# EAGLE design ventmon_t0.5e (EAGLE 9.6.2)

## Sheet 1 of 2

## Sheet 2 of 2
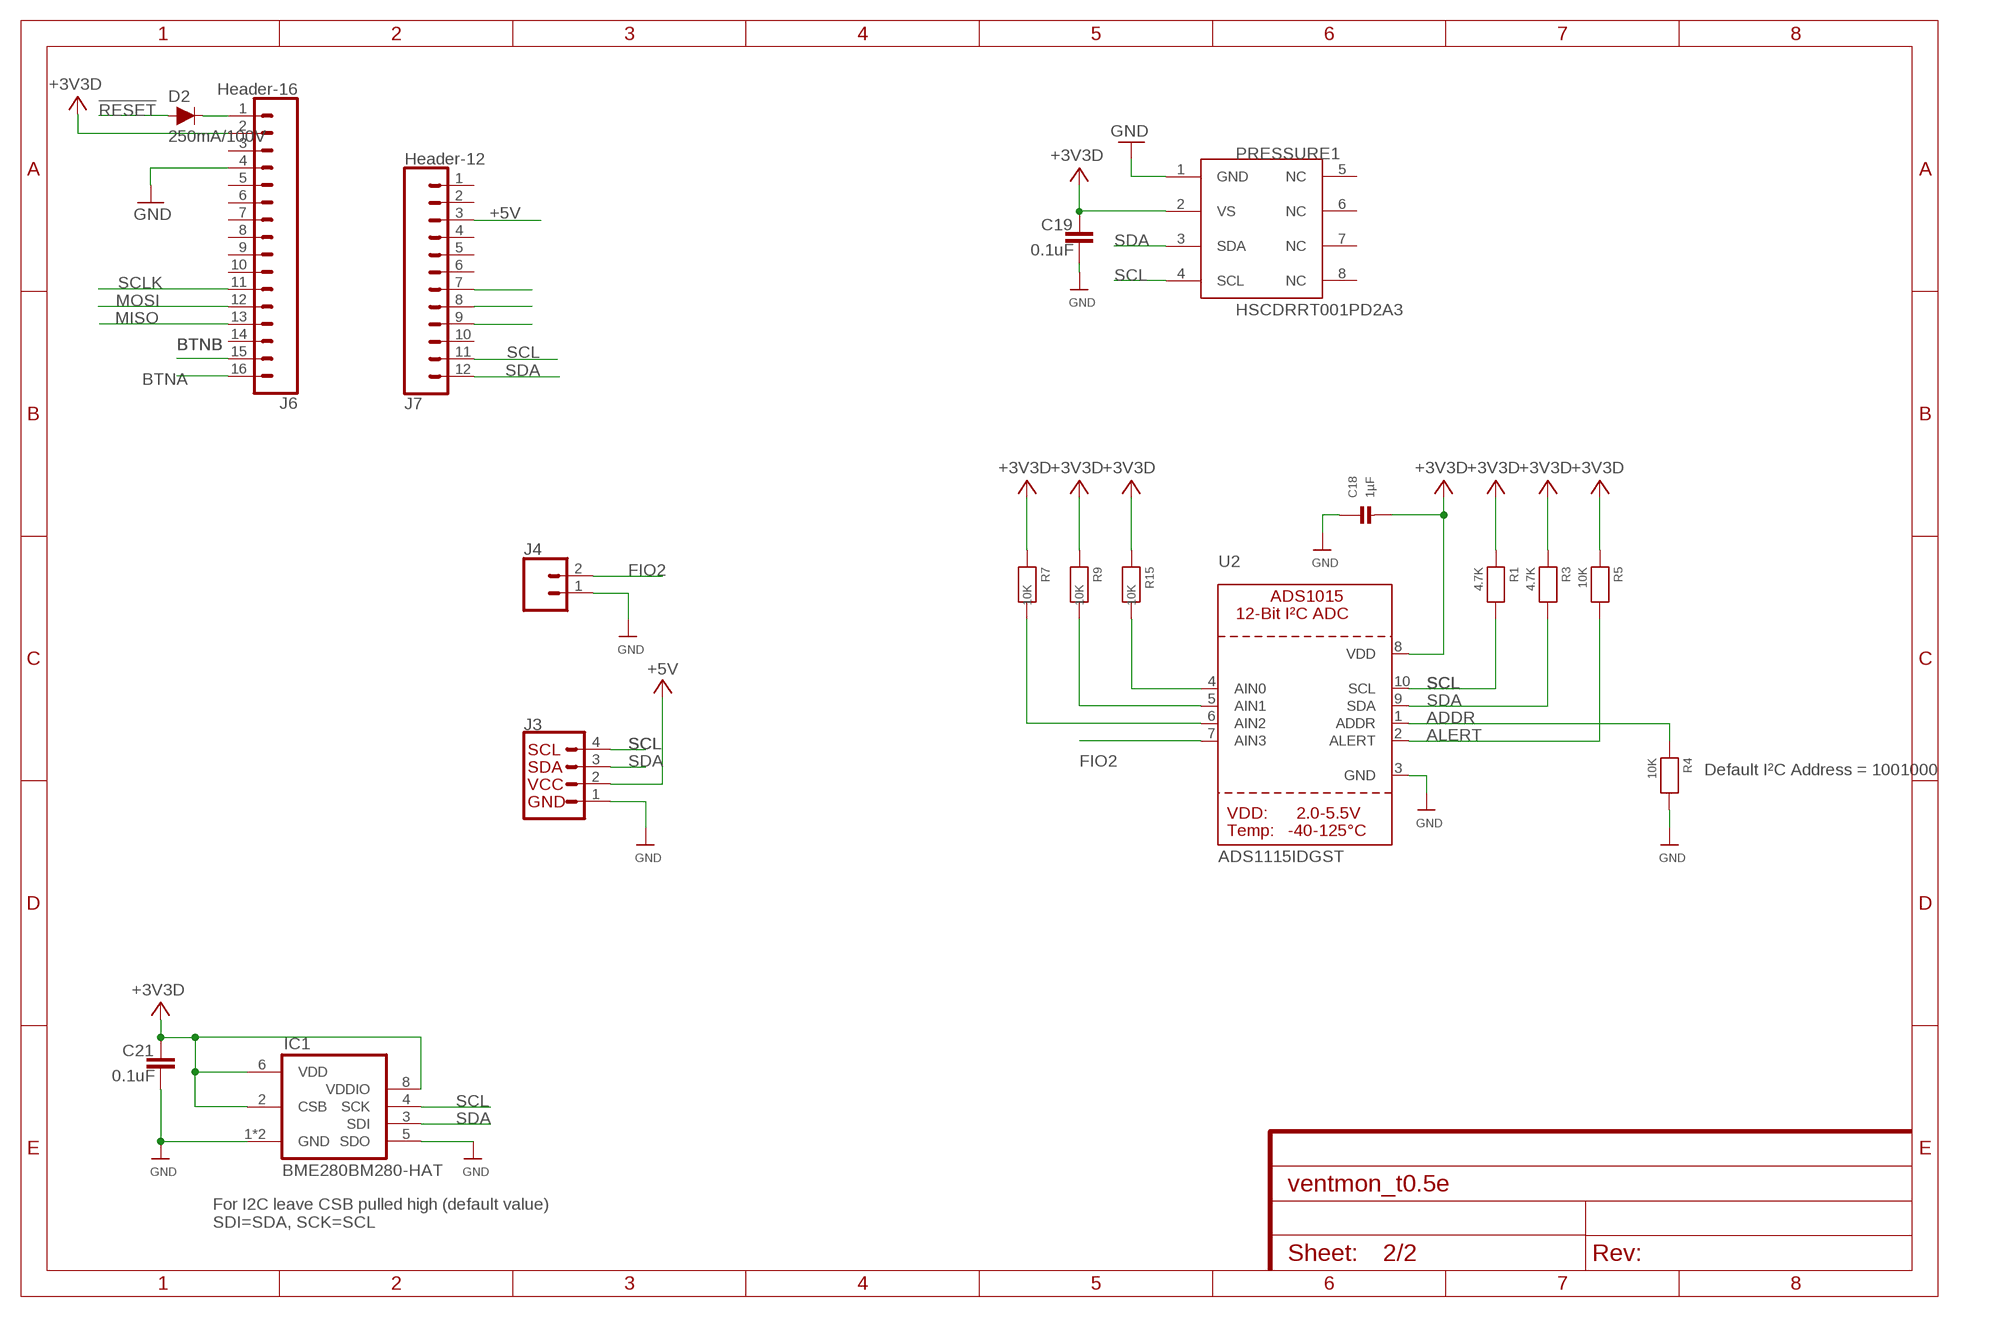
[diagram p0: schematic, sheet 2]

### Parts
C18  1µF  CAP_CERAMIC0603  [0603]
C19  0.1uF  CAP_1  [C0402_B]
C21  0.1uF  CAP_1  [C0402_B]
D2  250mA/100V  DIODE-BAS16J  [SOD-323]
IC1  BME280BM280-HAT  [BME280-HAT]
J3  QWIIC_CONNECTORJS-1MM  [1X04_1MM_RA]
J4  CONN_02  [1X02]
J6  Header-16  CONN_16  [1X16]
J7  Header-12  CONN_12  [1X12]
PRESSURE1  HSCDRRT001PD2A3  [DIP1330W46P254L1000H616Q8B]
R1  4.7K  RESISTOR0603  [0603]
R3  4.7K  RESISTOR0603  [0603]
R4  10K  RESISTOR0603  [0603]
R5  10K  RESISTOR0603  [0603]
R7  10K  RESISTOR0603  [0603]
R9  10K  RESISTOR0603  [0603]
R15  10K  RESISTOR0603  [0603]
U2  ADS1115IDGST  ADC_ADS1015  [MSOP10]

### Nets
!RESET: D2.A
+3V3: C18.2 C19.2 C21.2 IC1.2(CSB) IC1.6(VDD) IC1.8(VDDIO) J6.2 PRESSURE1.2(VS) R1.1 R3.1 R5.1 R7.1 R9.1 R15.1 U2.8(VDD) ; supply symbol labelled +3V3D
+5V: J3.2(VCC) J7.3
ADDR: R4.1 U2.1(ADDR)
ALERT: R5.2 U2.2(ALERT)
BTNA: J6.16
BTNB: J6.15
FIO2: J4.2 U2.7(AIN3)
GND: C18.1 C19.1 C21.1 IC1.1(GND) IC1.5(SDO) IC1.7(GND) J3.1(GND) J4.1 J6.4 PRESSURE1.1(GND) R4.2 U2.3(GND)
MISO: J6.13
MOSI: J6.12
N$4: D2.C J6.1
N$24: J7.7
N$25: J7.8
N$26: J7.9
N$38: R7.2 U2.6(AIN2)
N$40: R9.2 U2.5(AIN1)
N$45: R15.2 U2.4(AIN0)
SCL: IC1.4(SCK) J3.4(SCL) J7.11 PRESSURE1.4(SCL) R1.2 U2.10(SCL)
SCLK: J6.11
SDA: IC1.3(SDI) J3.3(SDA) J7.12 PRESSURE1.3(SDA) R3.2 U2.9(SDA)
Unconnected: J6.3 J6.5 J6.6 J6.7 J6.8 J6.9 J6.10 J6.14 J7.1 J7.2 J7.4 J7.5 J7.6 J7.10 PRESSURE1.5(NC) PRESSURE1.6(NC) PRESSURE1.7(NC) PRESSURE1.8(NC)

### Notes on the sheet
- Default I²C Address = 1001000
- For I2C leave CSB pulled high (default value)
  SDI=SDA, SCK=SCL

## Library data of the parts
C18 = microbuilder:CAP_CERAMIC: Ceramic Capacitors 0402 - 0402 Surface Mount Capacitors 16pF 50V 5% [Digikey: 445-4899-2-ND] 18pF 50V 5% [Digikey: 490-1281-2-ND] 22pF 50V 5% [Digikey: 490-1283-2-ND] 68pF 50V 5% [Digikey: 490-1289-2-ND] 0.1uF 10V 10% [Digikey: 490-1318-2-ND] 1.0uF 6.3V 10% [Digikey: 490-1320-2-ND] 0603 - 0603 Surface Mount Capacitors 16 pF 50V 5% [Digikey: 445-5051-2-ND] 22 pF 50V [Digikey: PCC220ACVTR-ND] 33 pF 50V 5% [Digikey: 490-1415-1-ND] 56pF 50V 5% [Digikey: 490-1421-1-ND] 220pF 50V 5% [Digikey: 445-1285-1-ND] 680 pF 50V 2200 pF 50V 5% C0G [Digikey: 445-1297-1-ND] 5600 pF 100V 5% X7R [Digikey: 478-3711-1-ND] 0.1 µF 25V 10% [Digikey: PCC2277TR-ND] 0.22 µF 16V 10% X7R [Digikey: 445-1318-1-ND] 1.0 µF 25V 10% [Digikey: 445-5146-2-ND] 0603 - RF Specific 3pF 250V +/-0.1pF RF [Digikey: 712-1347-1-ND] 18 pF 250V 5% [Digikey: 478-3505-1-ND or 712-1322-1-ND] 56 pF 250V 5% C0G RF [Digikey: 490-4867-1-ND] 68 pF 250V RF [Digikey: 490-4868-1-ND] 0805 - 0805 Surface Mount Capacitors 220 pF 250V 2% RF Ceramic Capacitor [Digikey: 712-1398-1-ND] 1000 pF 50V 2% NP0 Ceramic Capacitor [Digikey: 478-3760-1-ND] 0.1 µF 25V 10% Ceramic Capacitor [Digikey: PCC1828TR-ND] 1.0 µF 16V 10% Ceramic Capacitor[Digikey: 490-1691-2-ND] 10.0 µF 10V 10% Ceramic Capacitor[Digikey: 709-1228-1-ND] 10.0 uF 16V 10% Ceramic Capacitor [Digikey: 478-5165-2-ND] 47 uF 6.3V 20% Ceramic Capacitor [Digikey: 587-1779-1-ND or 399-5506-1-ND] 1206 - 1206 Surface Mount Capacitors 47uF 10V 20% Ceramic Capacitor [Digikey: 490-5528-1-ND or 399-5508-1-ND or 445-6010-1-ND] 100uF 6.3V -20%, +80% Y5V Ceramic Capacitor (Digikey: 490-4512-1-ND, Mouser: 81-GRM31CF50J107ZE1L)
C19 C21 = Particle:CAP_1
D2 = SparkFun-DiscreteSemi:DIODE: Diode These are standard reverse protection diodes and small signal diodes. SparkFun Products: SparkFun SparkPunk Sound Kit <https://www.sparkfun.com/products/11177> SparkFun ESP8266 Thing <https://www.sparkfun.com/products/13231>; PROD_ID: DIO-09646
IC1 = bosch-bme280:BME280: DIGITAL HUMIDITY, PRESSURE AND TEMPERATURE SENSOR * Digital interface I²C (up to 3.4 MHz) and SPI (3 and 4 wire, up to 10 MHz)* Supply voltage VDD main supply voltage range: 1.71 V to 3.6 V*VDDIO interface voltage range: 1.2 V to 3.6 V Operating range -40…+85 °C, 0…100 % rel. humidity, 300…1100 hPa The library has been designed by Richard Magdycz <https://www.facebook.com/groups/eaglecadsoftUK>
J3 = SparkFun-Connectors:QWIIC_CONNECTOR: SparkFun I2C Standard Qwiic Connector An SMD 1mm pitch JST connector makes it easy and quick (get it? Qwiic?) to connect I2C devices to each other. The Qwiic system <http://www.sparkfun.com/qwiic> enables fast and solderless connection between popular platforms and various sensors and actuators. We carry 200mm <https://www.sparkfun.com/products/14204>, 100mm <https://www.sparkfun.com/products/14205>, 50mm <https://www.sparkfun.com/products/14206>, and breadboard friendly <https://www.sparkfun.com/products/14207> Qwiic cables. We also offer 10 pcs strips <https://www.sparkfun.com/products/14323> the SMD connectors.
J4 = SparkFun-Connectors:CONN_02: Multi connection point. Often used as Generic Header-pin footprint for 0.1 inch spaced/style header connections On any of the 0.1 inch spaced packages, you can populate with these: Break Away Headers - Straight <https://www.sparkfun.com/products/116> (PRT-00116) Break Away Male Headers - Right Angle <https://www.sparkfun.com/products/553> (PRT-00553) Female Headers <https://www.sparkfun.com/products/115> (PRT-00115) Break Away Headers - Machine Pin <https://www.sparkfun.com/products/117> (PRT-00117) Break Away Female Headers - Swiss Machine Pin <https://www.sparkfun.com/products/743> (PRT-00743) For SCREWTERMINALS and SPRING TERMINALS visit here: Screw Terimnals on SparkFun.com <https://www.sparkfun.com/search/results?term=Screw+Terminals> (5mm/3.5mm/2.54mm spacing) This device is also useful as a general connection point to wire up your design to another part of your project. Our various solder wires solder well into these plated through hole pads. Hook-Up Wire - Assortment (Stranded, 22 AWG) <https://www.sparkfun.com/products/11375> (PRT-11375) Hook-Up Wire - Assortment (Solid Core, 22 AWG) <https://www.sparkfun.com/products/11367> (PRT-11367) View the entire wire category on our website here <https://www.sparkfun.com/categories/141> Special notes: Molex polarized connector foot print use with: PRT-08233 with associated crimp pins and housings. 2.54_SCREWTERM for use with PRT-10571. 3.5mm Screw Terminal footprints for PRT-08084 5mm Screw Terminal footprints for use with PRT-08432
J6 = SparkFun-Connectors:CONN_16: Multi connection point. Often used as Generic Header-pin footprint for 0.1 inch spaced/style header connections On any of the 0.1 inch spaced packages, you can populate with these: Break Away Headers - Straight <https://www.sparkfun.com/products/116> (PRT-00116) Break Away Male Headers - Right Angle <https://www.sparkfun.com/products/553> (PRT-00553) Female Headers <https://www.sparkfun.com/products/115> (PRT-00115) Break Away Headers - Machine Pin <https://www.sparkfun.com/products/117> (PRT-00117) Break Away Female Headers - Swiss Machine Pin <https://www.sparkfun.com/products/743> (PRT-00743) For SCREWTERMINALS and SPRING TERMINALS visit here: Screw Terimnals on SparkFun.com <https://www.sparkfun.com/search/results?term=Screw+Terminals> (5mm/3.5mm/2.54mm spacing) This device is also useful as a general connection point to wire up your design to another part of your project. Our various solder wires solder well into these plated through hole pads. Hook-Up Wire - Assortment (Stranded, 22 AWG) <https://www.sparkfun.com/products/11375> (PRT-11375) Hook-Up Wire - Assortment (Solid Core, 22 AWG) <https://www.sparkfun.com/products/11367> (PRT-11367) View the entire wire category on our website here <https://www.sparkfun.com/categories/141> Special notes: Molex polarized connector foot print use with SKU : PRT-08231 with associated crimp pins and housings. 1MM SMD Version SKU: PRT-10208 NOTES ON THE VARIANTS LOCK and LOCK_LONGPADS... This footprint was designed to help hold the alignment of a through-hole component (i.e. 6-pin header) while soldering it into place. You may notice that each hole has been shifted either up or down by 0.005 of an inch from it's more standard position (which is a perfectly straight line). This slight alteration caused the pins (the squares in the middle) to touch the edges of the holes. Because they are alternating, it causes a "brace" to hold the component in place. 0.005 has proven to be the perfect amount of "off-center" position when using our standard breakaway headers. Although looks a little odd when you look at the bare footprint, once you have a header in there, the alteration is very hard to notice. Also,if you push a header all the way into place, it is covered up entirely on the bottom side.
J7 = SparkFun-Connectors:CONN_12: Multi connection point. Often used as Generic Header-pin footprint for 0.1 inch spaced/style header connections On any of the 0.1 inch spaced packages, you can populate with these: Break Away Headers - Straight <https://www.sparkfun.com/products/116> (PRT-00116) Break Away Male Headers - Right Angle <https://www.sparkfun.com/products/553> (PRT-00553) Female Headers <https://www.sparkfun.com/products/115> (PRT-00115) Break Away Headers - Machine Pin <https://www.sparkfun.com/products/117> (PRT-00117) Break Away Female Headers - Swiss Machine Pin <https://www.sparkfun.com/products/743> (PRT-00743) For SCREWTERMINALS and SPRING TERMINALS visit here: Screw Terimnals on SparkFun.com <https://www.sparkfun.com/search/results?term=Screw+Terminals> (5mm/3.5mm/2.54mm spacing) This device is also useful as a general connection point to wire up your design to another part of your project. Our various solder wires solder well into these plated through hole pads. Hook-Up Wire - Assortment (Stranded, 22 AWG) <https://www.sparkfun.com/products/11375> (PRT-11375) Hook-Up Wire - Assortment (Solid Core, 22 AWG) <https://www.sparkfun.com/products/11367> (PRT-11367) View the entire wire category on our website here <https://www.sparkfun.com/categories/141> Special notes: Molex polarized connector foot print use with SKU : PRT-08231 with associated crimp pins and housings. 1MM SMD Version SKU: PRT-10208 NOTES ON THE VARIANTS LOCK and LOCK_LONGPADS... This footprint was designed to help hold the alignment of a through-hole component (i.e. 6-pin header) while soldering it into place. You may notice that each hole has been shifted either up or down by 0.005 of an inch from it's more standard position (which is a perfectly straight line). This slight alteration caused the pins (the squares in the middle) to touch the edges of the holes. Because they are alternating, it causes a "brace" to hold the component in place. 0.005 has proven to be the perfect amount of "off-center" position when using our standard breakaway headers. Although looks a little odd when you look at the bare footprint, once you have a header in there, the alteration is very hard to notice. Also,if you push a header all the way into place, it is covered up entirely on the bottom side.
PRESSURE1 = HSCDRRT001PD2A3:HSCDRRT001PD2A3: Honeywell Differential Pressure Sensor Pressure Sensor ±1PSI (±6.89kPa) Differential Male - 0.08" (1.93mm) Tube, Dual 12 b 8-DIP (0.524", 13.30mm), Dual Ports, Same Side, I2C https://www.digikey.com/product-detail/en/honeywell-sensing-and-productivity-solutions/HSCDRRT001PD2A3/480-3335-ND/2601662
R1 R3-R5 R7 R9 R15 = microbuilder:RESISTOR: Resistors 0402 - 0402 Surface Mount Package 22 Ohm 1% 1/16W [Digikey: 311-22.0LRTR-ND] 33 Ohm 5% 1/16W 1.0K 5% 1/16W 1.5K 5% 1/16W 2.0K 1% 1/16W 10.0K 1% 1/16W [Digikey: 311-10.0KLRTR-ND] 10.0K 5% 1/16W [Digikey: RMCF0402JT10K0TR-ND] 12.1K 1% 1/16W [Digikey: 311-22.0LRTR-ND] 100.0K 5% 1/16W 0603 - 0603 Surface Mount Package 0 Ohm 1/10 Watt 1% Resistor 15 Ohm 1/10 Watt 1% Resistor 33 Ohm 1/10 Watt 1% Resistor 49.9 Ohm 1/10 Watt 1% Resistor 100 Ohm 1/10 Watt 1% Resistor 150 Ohm 1/10 Watt 1% Resistor 240 Ohm 1/10 Watt 1% Resistor 390 Ohm 1/10 Watt 1% Resistor 560 Ohm 1/10 Watt 1% Resistor 680 Ohm 1/10 Watt 1% Resistor 750 Ohm 1/10 Watt 1% Resistor 1.0K Ohm 1/10 Watt 1% Resistor 1.5K Ohm 1/10 Watt 1% Resistor 2.0K Ohm 1/10 Watt 1% Resistor 2.2K Ohm 1/10 Watt 1% Resistor 3.3K Ohm 1/10 Watt 1% Resistor 4.7K Ohm 1/10 Watt 1% Resistor 10.0K Ohm 1/10 Watt 1% Resistor 12.0K Ohm 1/10 Watt 1% Resistor 12.1K Ohm 1/10 Watt 1% Resistor 20.0K Ohm 1/10 Watt 1% Resistor 33.0K Ohm 1/10 Watt 1% Resistor 100.0K Ohm 1/10 Watt 1% Resistor 0805 - 0805 Surface Mount Package 0 Ohm 1/8 Watt 1% Resistor 33 Ohm 1/8 Watt 1% Resistor 100 Ohm 1/8 Watt 1% Resistor 150 Ohm 1/8 Watt 1% Resistor 200 Ohm 1/8 Watt 1% Resistor 240 Ohm 1/8 Watt 1% Resistor 330 Ohm 1/8 Watt 1% Resistor 390 Ohm 1/8 Watt 1% Resistor 470 Ohm 1/8 Watt 1% Resistor 1.0K Ohm 1/8 Watt 1% Resistor 1.5K Ohm 1/8 Watt 1% Resistor 2.0K Ohm 1/8 Watt 1% Resistor 4.7K Ohm 1/8 Watt 1% Resistor 5.1K Ohm 1/8 Watt 1% Resistor 5.6K Ohm 1/8 Watt 1% Resistor 10.0K Ohm 1/8 Watt 1% Resistor 22.0K Ohm 1/8 Watt 1% Resistor 33.0K Ohm 1/8 Watt 1% Resistor 100K Ohm 1/8 Watt 1% Resistor 1206 - 1206 Surface Mount Package 2012 - 2010 Surface Mount Package 0.11 Ohm 1/2 Watt 1% Resistor - Digikey: RHM.11UCT-ND
U2 = microbuilder:ADC_ADS1015: ADS1015 - 12-bit 4-Channel I2C ADC with Internal PGA VDD: 2.0-5.5V Sampling Rate: 3.3ksps Gain Settings: 2/3, 1, 2, 4, 8, 16 I2C Address: ADDR low = 1001000x, ADDR high = 1001001x Internal Comparator The ADS1015 includes an internal comparator that can be set to output a high-level on ALERT when the conversion results exceeeds a pre-defined upper level, and will deassert itself when the level falls below a pre-defined lower threshold level. It can also be set to windowed mode where the ALERT pin will be asserted if the data exceeds the upper threshold or falls below the lower threshold.

## Board
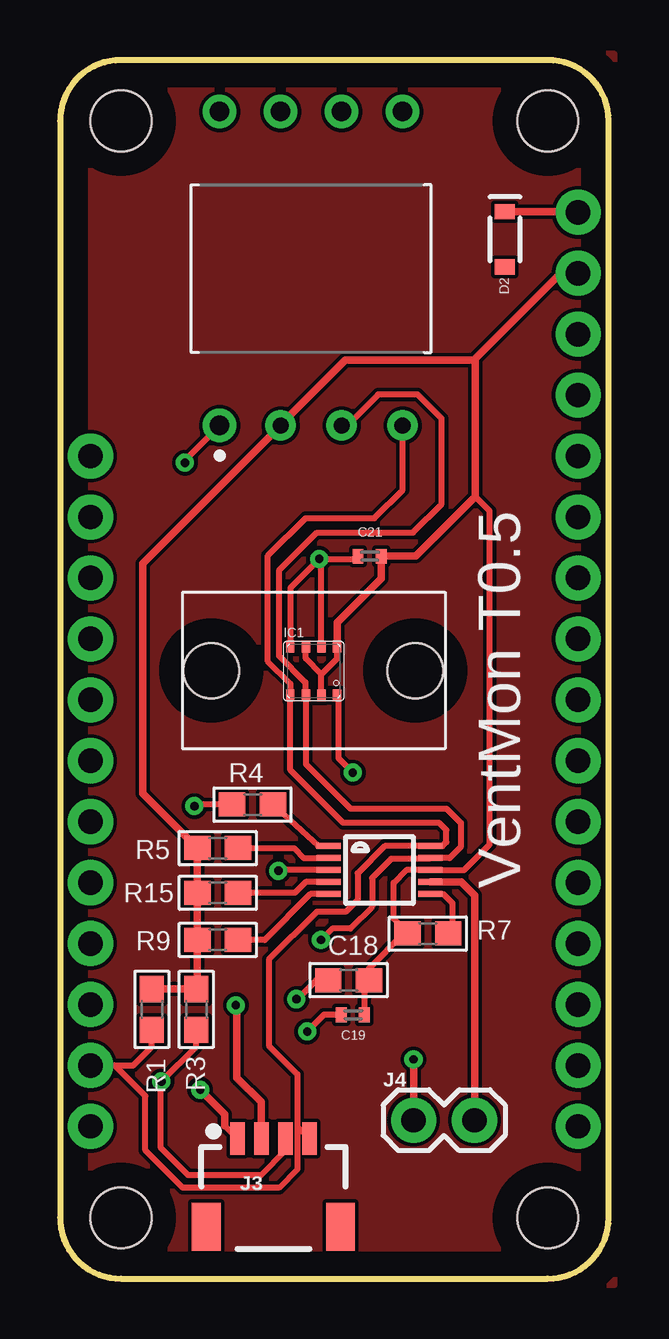
[diagram p1: board, top side]
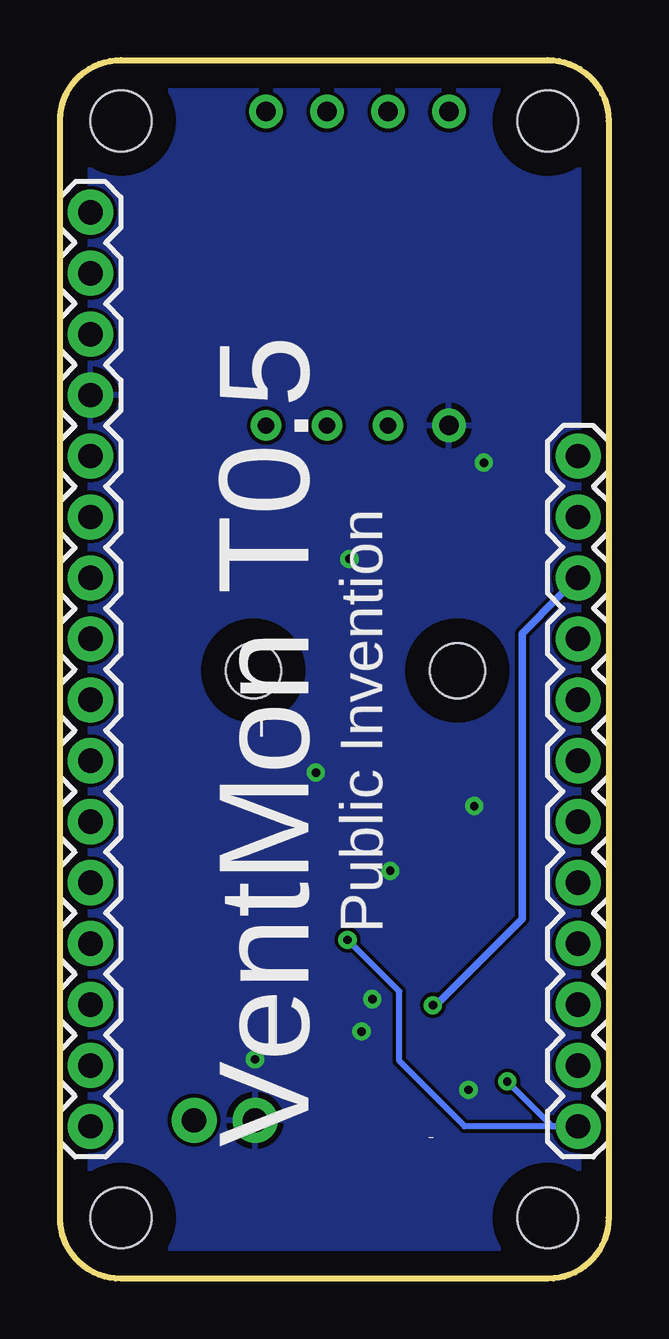
[diagram p2: board, bottom side, seen from below]

Size 22.86 x 50.8 mm. Coordinates in mm from the lower left corner, seen from the top.
Outline: 20.32,50.8 2.54,50.8 arc90 0,48.26 0,2.54 arc90 2.54,0 20.32,0 arc90 22.86,2.54 22.86,48.26 arc90 20.32,50.8
Copper layers (1*16): Top 0.035mm / dielectric 1.5mm / Bottom 0.035mm
Design rules "default *": minimum track width 6mil, minimum drill 10mil, track to track 6mil, track to pad 6mil, pad to pad 6mil, via to via 6mil, smd to smd 6mil, copper to edge 40mil, drill to drill 6mil, minimum pad ring 10mil, minimum via ring 8mil, stop-mask expansion 4mil, vias tented up to drill 0.35mm, thermal gap 10mil
Holes 2.54 mm at 20.32,48.26 2.54,48.26 2.54,2.54 20.32,2.54

### Footprints (pad centres in the part's own frame; a part is rotated, then mirrored left to right if it is on the bottom)
0603 = smd 1.1 x 1: 1 -0.85,0; 2 0.85,0
C0402_B = smd 0.457 x 0.61: 1 -0.483,0; 2 0.483,0
SOD-323 = smd 0.63 x 0.83: A 1.15,0; C -1.15,0
BME280-HAT = smd 0.35 x 0.5: 1 2.245,-2.295; 2 1.595,-2.295; 3 0.945,-2.295; 4 0.295,-2.295; 5 0.295,-0.245; 6 0.945,-0.245; 7 1.595,-0.245; 8 2.245,-0.245 | hole 2.3: 5.5,-1.25; -3,-1.25
1X04_1MM_RA = smd 0.6 x 1.35: 1 -1.5,0; 2 -0.5,0; 3 0.5,0; 4 1.5,0 | smd 1.2 x 2: NC1 2.8,-3.675; NC2 -2.8,-3.675
1X02 = drill 1.016 pad 1.88: 1 0,0; 2 2.54,0
1X16 = drill 1.016 pad 1.88: 1 0,0; 2 2.54,0; 3 5.08,0; 4 7.62,0; 5 10.16,0; 6 12.7,0; 7 15.24,0; 8 17.78,0; 9 20.32,0; 10 22.86,0; 11 25.4,0; 12 27.94,0; 13 30.48,0; 14 33.02,0; 15 35.56,0; 16 38.1,0
1X12 = drill 1.016 pad 1.88: 1 0,0; 2 2.54,0; 3 5.08,0; 4 7.62,0; 5 10.16,0; 6 12.7,0; 7 15.24,0; 8 17.78,0; 9 20.32,0; 10 22.86,0; 11 25.4,0; 12 27.94,0
DIP1330W46P254L1000H616Q8B = drill 0.813 pad 1.397: 1 -6.54,3.81; 5 6.54,-3.81; 6 6.54,-1.27; 7 6.54,1.27; 8 6.54,3.81 | drill 0.675 pad 1.275: 2 -6.54,1.27; 3 -6.54,-1.27; 4 -6.54,-3.81
MSOP10 = smd 0.25 x 1: 1 -1,-2.113; 2 -0.5,-2.113; 3 0,-2.113; 4 0.5,-2.113; 5 1,-2.113; 6 1,2.113; 7 0.5,2.113; 8 0,2.113; 9 -0.5,2.113; 10 -1,2.113

### Placement (x,y rotation side)
C18  12.03,12.44 0 top
C19  12.2,11 0 top
C21  12.9,30.12 0 top
D2  18.54,43.32 270 top
IC1  9.3,26.6 0 top
J3  8.89,5.84 0 top
J4  14.73,6.6 0 top
J6  21.59,44.45 270 bottom
J7  1.27,34.29 270 bottom
PRESSURE1  10.46,42.1 90 top
R1  3.83,11.22 270 top
R3  5.68,11.22 270 top
R4  8.02,19.76 180 top
R5  6.57,17.95 0 top
R7  15.32,14.39 0 top
R9  6.57,14.12 0 top
R15  6.57,16.08 0 top
U2  13.31,17.03 270 top

### Tracks (layer width: path | path; a pad name or v marks a point on that pad's centre or on a via)
+3V3
  Top 0.254: 17.3,32.6 17.9,32 17.9,18.1 16.83,17.03 U2.8 14.43,17.03 13.9,16.5 13.9,15 14.47,14.43 R7.1 14.31,14.38 12.88,12.95 C18.2 12.69,12.26 C19.2 | 10.89,25.2 11.54,25.84 IC1.8 | 10.89,25.2 10.24,25.84 IC1.6 | R3.1 5.72,12.12 | IC1.2 10.89,25.2
  Top 0.305: IC1.8 11.54,27.34 13.38,29.18 C21.2 14.82,30.12 17.3,32.6 17.3,38.35 | J6.2 20.86,41.91 17.3,38.35 | 17.3,38.35 17.25,38.3 11.88,38.3 9.2,35.61 PRESSURE1.2 3.45,29.82 3.45,20.23 R5.1 R15.1 R9.1 5.72,12.12 | R3.1 R1.1
+5V  (via drill 0.35)
  Top 0.305: J3.2 8.39,7.37 7.37,8.38 7.37,11.35 v7.32,11.4
  Bottom 0.305: J7.3 2.01,28.49 3.6,26.9 3.6,15 7.2,11.4 v7.32,11.4
ADDR
  Top 0.254: R4.1 10.75,18.03 U2.1
ALERT
  Top 0.254: R5.2 9.75,17.95 10.17,17.53 U2.2
FIO2
  Top 0.305: U2.7 16.72,16.53 17.27,15.98 J4.2
GND  (via drill 0.35)
  Top 0.254: 7.01,19.7 R4.2 5.66,19.76 v5.6,19.7 | IC1.5 9.6,28.8 v10.8,30 | IC1.7 10.89,29.91 v10.8,30 | PRESSURE1.1 5.2,34.11 v5.2,34.02 | U2.3 9.13,17.03 v9.1,17 | IC1.1 11.6,24.25 11.6,21.7 v12.2,21.1 | C18.1 10.67,12.45 9.88,11.65 v9.85,11.65 | C19.1 10.99,11 v10.3,10.31 | v10.8,30 12.3,30 C21.1 | J3.1 6.86,6.37
  Top 0.305: 6.86,6.37 6.86,6.86 v5.84,7.87 | J4.1 v14.73,9.14
  pour Bottom: 22.98,50.8 22.98,-0.2 -0.09,-0.2 -0.09,50.99
N$1
  pour Top: 0,51.05 0,-0.25 23.11,-0.25 23.11,51.05
N$4
  Top 0.305: J6.1 21.5,44.48 18.58,44.48 18.57,44.47 D2.C
N$38
  Top 0.254: U2.6 15.97,16.03 16.35,15.66 16.35,14.56 R7.2
N$40
  Top 0.254: U2.5 10.44,16.03 8.53,14.12 R9.2
N$45
  Top 0.254: R15.2 9.78,16.08 10.23,16.53 U2.4
SCL
  Top 0.254: PRESSURE1.4 14.28,32.88 13.1,31.7 10.23,31.7 8.67,30.13 8.67,25.73 9.6,24.8 IC1.4 9.6,21.2 11.8,19 15.8,19 16.1,18.7 16.1,18.2 15.93,18.03 U2.10 13.53,18.03 12.4,16.9 12.4,15.8 11.9,15.3 10.7,15.3 8.71,13.31 8.71,9.71 9.89,8.52 9.89,6.34 | 9.89,6.34 J3.4 | 9.89,6.34 9.89,5.83 9.91,5.82 9.91,4.57 9.13,3.79 5.11,3.79 3.56,5.34 3.56,7.62 2.29,8.89 J7.11 3.05,8.89 3.83,9.67 R1.2
SDA  (via drill 0.35)
  Top 0.2: 10.22,24.33 IC1.3
  Top 0.254: 10.22,24.33 10.22,24.86 9.12,25.97 9.12,29.52 10.7,31.1 14.7,31.1 15.9,32.3 15.9,35.85 14.9,36.85 13.25,36.85 11.96,35.56 PRESSURE1.3 | IC1.3 10.24,21.45 12.1,19.6 16.1,19.6 16.7,19 16.7,18 16.23,17.53 U2.9 15.39,17.5 13.8,17.5 13,16.7 13,15.5 12.1,14.6 11.35,14.6 v10.88,14.12 | R3.2 5.68,9.67 5.67,9.67 v4.22,8.22 4.2,8.2 4.2,5.45 5.33,4.32 8.38,4.32 9.39,5.33 J3.3
  Bottom 0.254: v10.88,14.12 8.72,11.97 8.72,9.08 6,6.35 J7.12 2.35,6.35 v4.22,8.22

### Text on the board
tPlace: VentMon T0.5
bPlace: VentMon T0.5 | Public Invention